# Altium schematic sheet Schematic1.SchDoc
size A3; SheetNumber: 1; SheetTotal: 1
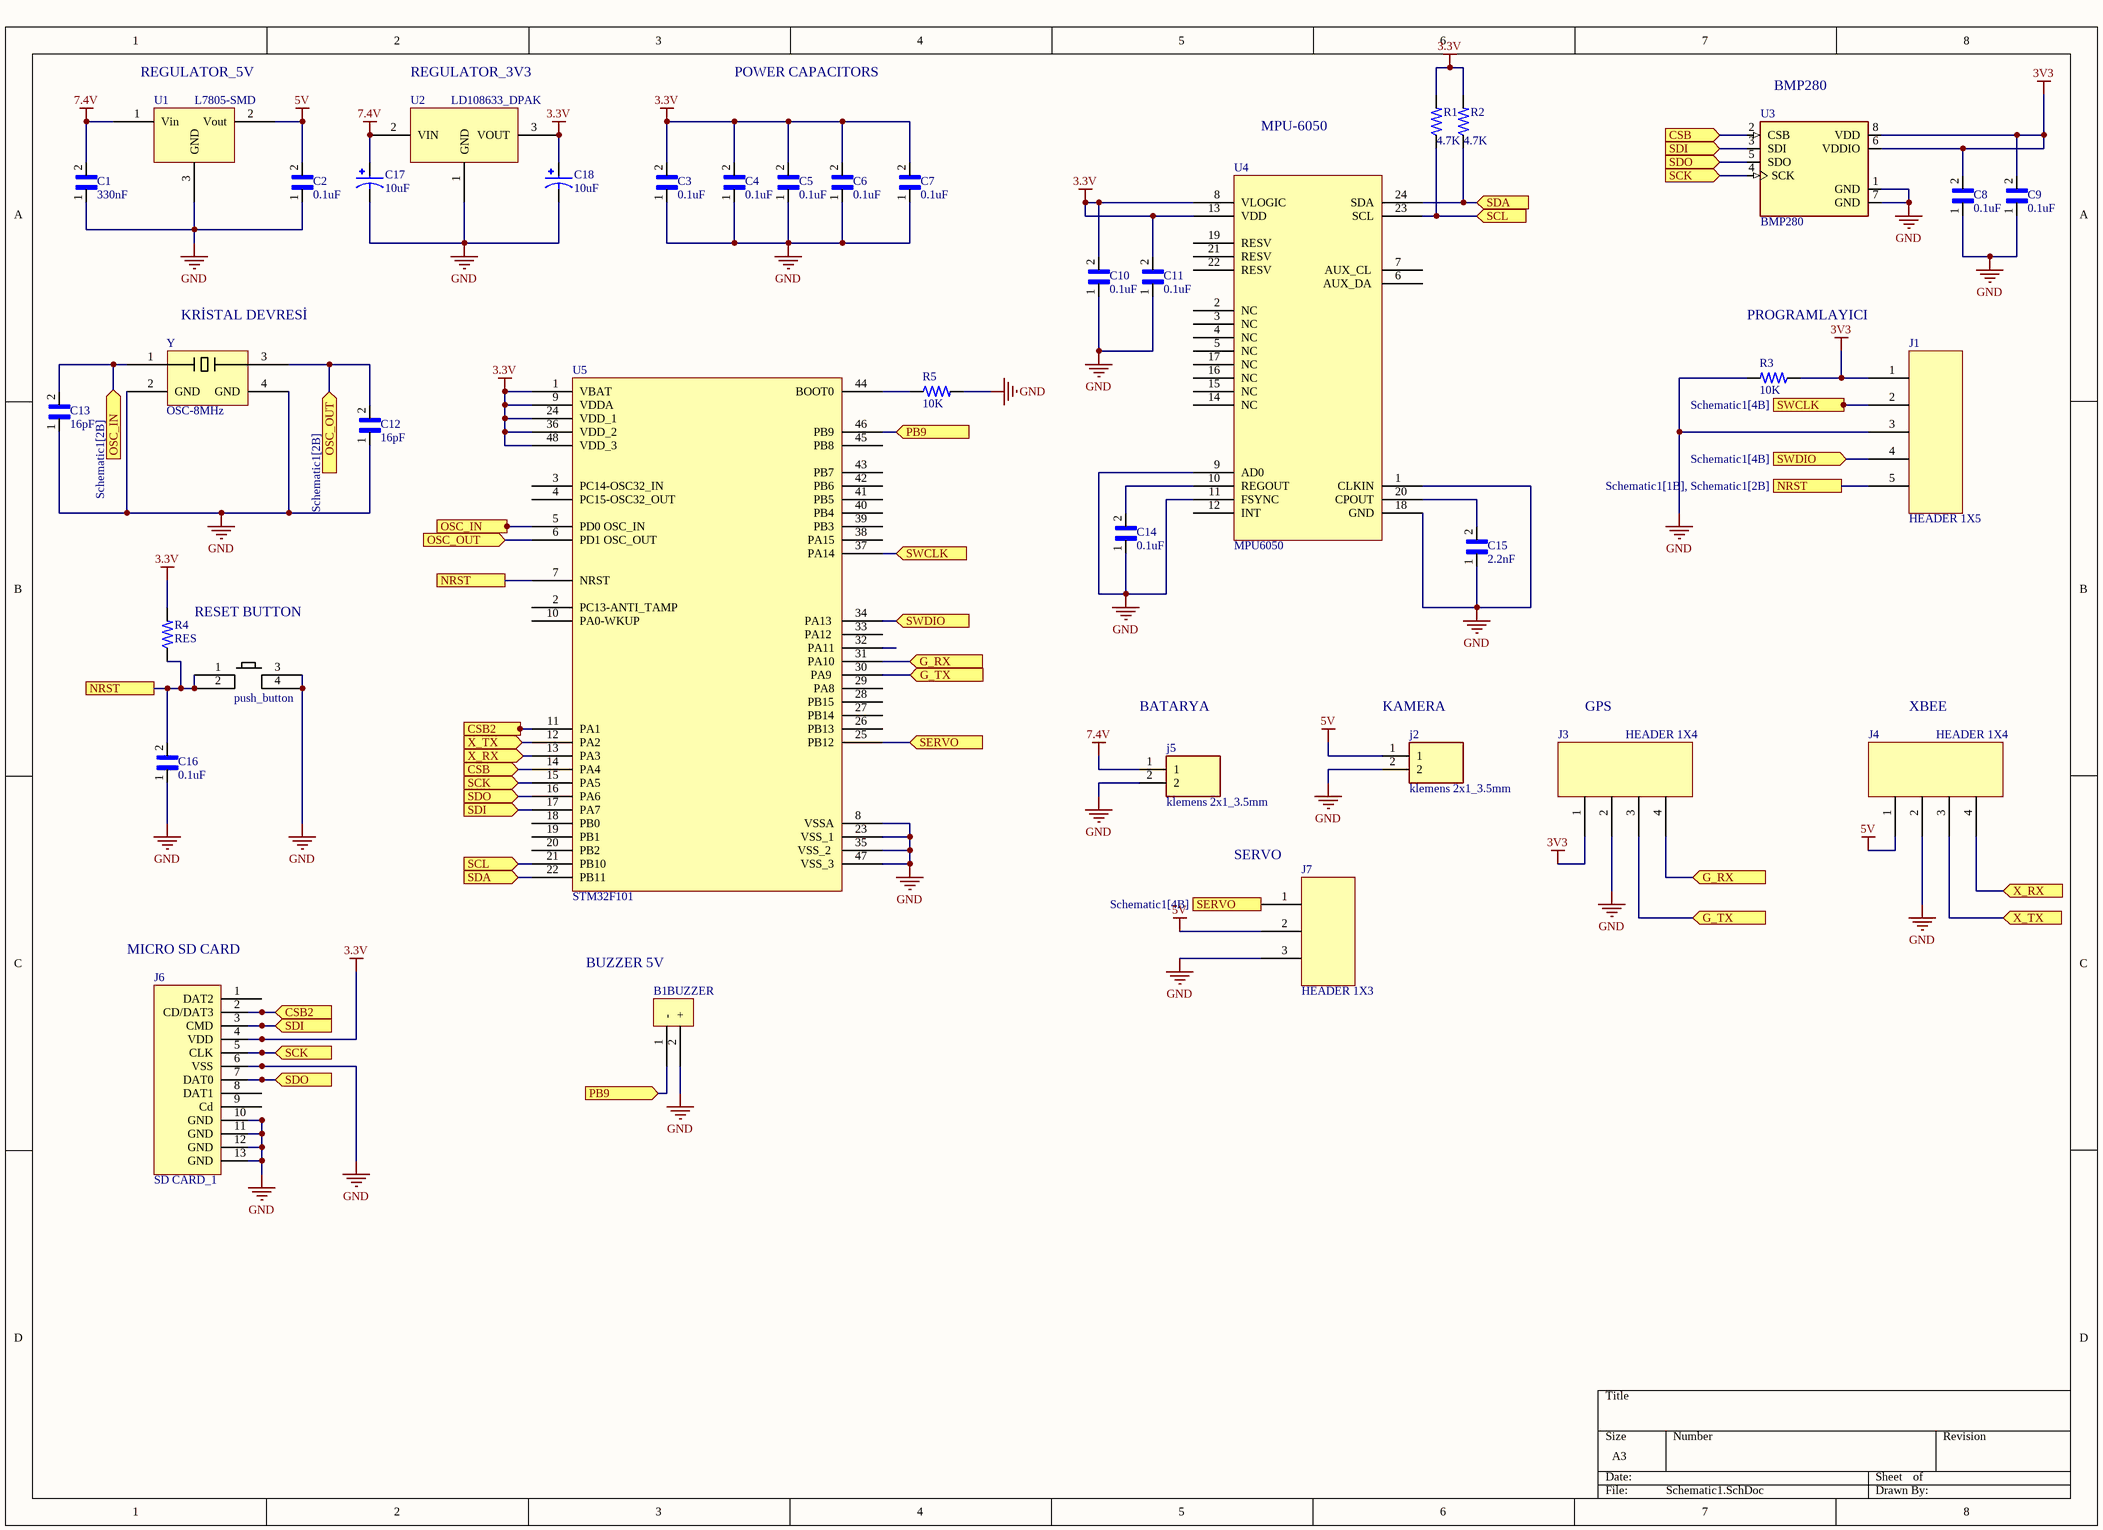
[diagram p0: Schematic1.SchDoc]

## Parts
?  push_button  [push_button]
B1  BUZZER  [Buzzer]
C1  330nF  [1206CAPACITOR]
C2  0.1uF  [1206CAPACITOR]
C3  0.1uF  [1206CAPACITOR]
C4  0.1uF  [1206CAPACITOR]
C5  0.1uF  [1206CAPACITOR]
C6  0.1uF  [1206CAPACITOR]
C7  0.1uF  [1206CAPACITOR]
C8  0.1uF  [1206CAPACITOR]
C9  0.1uF  [1206CAPACITOR]
C10  0.1uF  [1206CAPACITOR]
C11  0.1uF  [1206CAPACITOR]
C12  16pF  [1206CAPACITOR]
C13  16pF  [1206CAPACITOR]
C14  0.1uF  [1206CAPACITOR]
C15  2.2nF  [1206CAPACITOR]
C16  0.1uF  [1206CAPACITOR]
C17  10uF  [pol_smal_capacitor]
C18  10uF  [pol_smal_capacitor]
J1  HEADER 1X5  [HEADER 1X5_2.54mm]
j2  klemens 2x1_3.5mm  [KLEMENS 2X1_3.5mm - duplicate]
J3  HEADER 1X4  [HEADER 1X4_2.54mm]
J4  HEADER 1X4  [HEADER 1X4_2.54mm]
j5  klemens 2x1_3.5mm  [KLEMENS 2X1_3.5mm - duplicate]
J6  SD CARD_1  [SD CARD]
J7  HEADER 1X3  [HEADER 1X3_2.54]
R1  4.7K  [RES]
R2  4.7K  [RES]
R3  10K  [RES]
R4  RES  [RES]
R5  10K  [RES]
U1  L7805-SMD  [DPAK228P968X230-3N]
U2  LD108633_DPAK  [LD1086 3.3 REGULATOR]
U3  BMP280  [BMP280]
U4  MPU6050  [MPU6050]
U5  STM32F101  [PQFP48-STM]
Y  OSC-8MHz  [OSC KRISTAL]

## Ports
CSB2 (in, see Schematic1[2B]), CSB2 (in, see Schematic1[2C]), CSB (in, see Schematic1[2B]), CSB (in, see Schematic1[7A]), G_RX (in, see Schematic1[4B]), G_RX (in, see Schematic1[7C]), G_TX (in, see Schematic1[4B]), G_TX (in, see Schematic1[7C]), NRST (see Schematic1[1B], Schematic1[2B]), NRST (see Schematic1[1B], Schematic1[7B]), NRST (see Schematic1[2B], Schematic1[7B]), OSC_IN (in, see Schematic1[1B]), OSC_IN (in, see Schematic1[2B]), OSC_OUT (in, see Schematic1[2B]), PB9 (in, see Schematic1[3C]), PB9 (in, see Schematic1[4B]), SCK (in, see Schematic1[2C]), SCK (in, see Schematic1[2C], Schematic1[7A]), SCL (in, see Schematic1[2C]), SCL (in, see Schematic1[6A]), SDA (in, see Schematic1[2C]), SDA (in, see Schematic1[6A]), SDI (in, see Schematic1[2C]), SDI (in, see Schematic1[2C], Schematic1[7A]), SDO (in, see Schematic1[2C]), SDO (in, see Schematic1[2C], Schematic1[7A]), SERVO (in, see Schematic1[4B]), SERVO (in, see Schematic1[5C]), SWCLK (in, see Schematic1[4B]), SWCLK (in, see Schematic1[7B]), SWDIO (in, see Schematic1[4B]), SWDIO (in, see Schematic1[7B]), X_RX (in, see Schematic1[2B]), X_RX (in, see Schematic1[8C]), X_TX (in, see Schematic1[2B]), X_TX (in, see Schematic1[8C])

## Nets
3.3V: C3.2 C4.2 C5.2 C6.2 C7.2 C10.2 C11.2 C18.1 J6.4(VDD) R1.2 R2.2 R4.2 U2.3(VOUT) U4.8(VLOGIC) U4.13(VDD) U5.1(VBAT) U5.9(VDDA) U5.24(VDD_1) U5.36(VDD_2) U5.48(VDD_3)
3V3: C8.2 C9.2 J1.1 J3.1 R3.1 U3.6(VDDIO) U3.8(VDD)
5V: C2.2 j2.1 J4.1 J7.2 U1.2(Vout)
7.4V: C1.2 C17.1 j5.1 U1.1(Vin) U2.2(VIN)
GND: ?.3 ?.4 B1.2(+) C1.1 C2.1 C3.1 C4.1 C5.1 C6.1 C7.1 C8.1 C9.1 C10.1 C11.1 C12.1 C13.1 C14.1 C15.1 C16.1 C17.2 C18.2 J1.3 j2.2 J3.2 J4.2 j5.2 J6.6(VSS) J6.10(GND) J6.11(GND) J6.12(GND) J6.13(GND) J7.3 R3.2 R5.2 U1.3(GND) U2.1(GND) U3.1(GND) U3.7(GND) U4.1(CLKIN) U4.9(AD0) U4.11(FSYNC) U4.18(GND) U5.8(VSSA) U5.23(VSS_1) U5.35(VSS_2) U5.47(VSS_3) Y.2(GND) Y.4(GND)
CSB: U3.2(CSB) U5.14(PA4) ; port CSB
CSB2: J6.2(CD/DAT3) U5.11(PA1) ; port CSB2
G_RX: J3.4 U5.31(PA10) ; port G_RX
G_TX: J3.3 U5.30(PA9) ; port G_TX
NRST: ?.1 ?.2 C16.2 J1.5 R4.1 U5.7(NRST) ; port NRST
OSC_IN: C13.2 U5.5(PD0_OSC_IN) Y.1 ; port OSC_IN
OSC_OUT: C12.2 U5.6(PD1_OSC_OUT) Y.3 ; port OSC_OUT
PB9: B1.1(-) U5.46(PB9) ; port PB9
SCK: J6.5(CLK) U3.4(SCK) U5.15(PA5) ; port SCK
SCL: R1.1 U4.23(SCL) U5.21(PB10) ; port SCL
SDA: R2.1 U4.24(SDA) U5.22(PB11) ; port SDA
SDI: J6.3(CMD) U3.3(SDI) U5.17(PA7) ; port SDI
SDO: J6.7(DAT0) U3.5(SDO) U5.16(PA6) ; port SDO
SERVO: J7.1 U5.25(PB12) ; port SERVO
SWCLK: J1.2 U5.37(PA14) ; port SWCLK
SWDIO: J1.4 U5.34(PA13) ; port SWDIO
X_RX: J4.4 U5.13(PA3) ; port X_RX
X_TX: J4.3 U5.12(PA2) ; port X_TX
NetC14_2: C14.2 U4.10(REGOUT)
NetC15_2: C15.2 U4.20(CPOUT)
NetR5_1: R5.1 U5.44(BOOT0)

Not connected (* = marked no-connect by the designer): J6 1(DAT2) 8(DAT1) 9(Cd); U4 2(NC_) 3(NC_) 4(NC_) 5(NC_) 6(AUX_DA_) 7(AUX_CL_) 12(INT) 14(NC) 15(NC) 16(NC) 17(NC) 19(RESV) 21(RESV) 22(RESV); U5 2(PC13-ANTI_TAMP) 3(PC14-OSC32_IN) 4(PC15-OSC32_OUT) 10(PA0-WKUP) 18(PB0) 19(PB1) 20(PB2) 26(PB13) 27(PB14) 28(PB15) 29(PA8) 32(PA11) 33(PA12_) 38(PA15) 39(PB3) 40(PB4) 41(PB5) 42(PB6) 43(PB7) 45(PB8)

## Notes on the sheet
- (near U1) REGULATOR_5V
- REGULATOR_3V3
- POWER CAPACITORS
- MPU-6050
- (near U3) BMP280
- (near Y) KRİSTAL DEVRESİ
- PROGRAMLAYICI
- (near R4) RESET BUTTON
- BATARYA
- (near j2) KAMERA
- GPS
- XBEE
- (near J7) SERVO
- (near J6) MICRO SD CARD
- BUZZER 5V

## Library data of the parts
C1-C16 = 1206CAPACITOR
C17 C18 = pol small capacitor
R1-R3 R5 = RES
U1 = L7805-SMD: L7805-SMD REGULATOR
U2 = LD1086-3.3 Regulator
U5 = STM32F101: DATASHEET: https://datasheetspdf.com/pdf-file/598718/STMicroelectronics/STM32F101xB/1